# Altium schematic sheet CAN Transciever.SchDoc
size A4
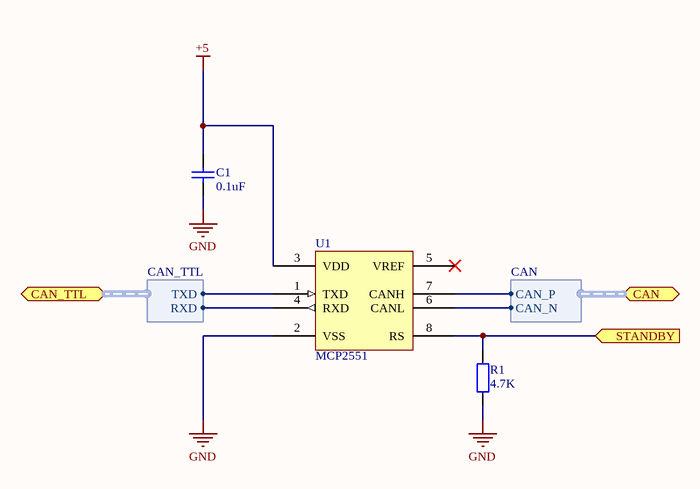
[diagram p0: CAN Transciever.SchDoc]

## Parts
C1  value 0.1uF  [C0603]  (hidden comment: Cap)
R1  value 4.7K  [R0603]  (hidden comment: Res)
U1  MCP2551  [MCP2551]

## Ports
CAN (harness CAN), CAN_TTL (harness CAN_TTL), STANDBY (in)

## Harnesses
CAN_TTL: TXD, RXD
CAN: CAN_P, CAN_N

## Nets
+5: C1.1 U1.3(VDD)
GND: C1.2 R1.1 U1.2(VSS)
STANDBY: R1.2 U1.8(RS) ; port STANDBY
NetU1_1: U1.1(TXD) ; port CAN_TTL.TXD
NetU1_4: U1.4(RXD) ; port CAN_TTL.RXD
NetU1_6: U1.6(CANL) ; port CAN.CAN_N
NetU1_7: U1.7(CANH) ; port CAN.CAN_P

Not connected (* = marked no-connect by the designer): U1 5(VREF)*

## Library data of the parts
C1 = Cap: Capacitor; farnell: 9406140
R1 = Res2: Resistor; farnell: 9331247
U1 = MCP2551: High-speed CAN Transceiver, 1Mb/s; farnell: 9758569